# EAGLE design MPS (EAGLE 9.6.2)

## Sheet 1 of 2
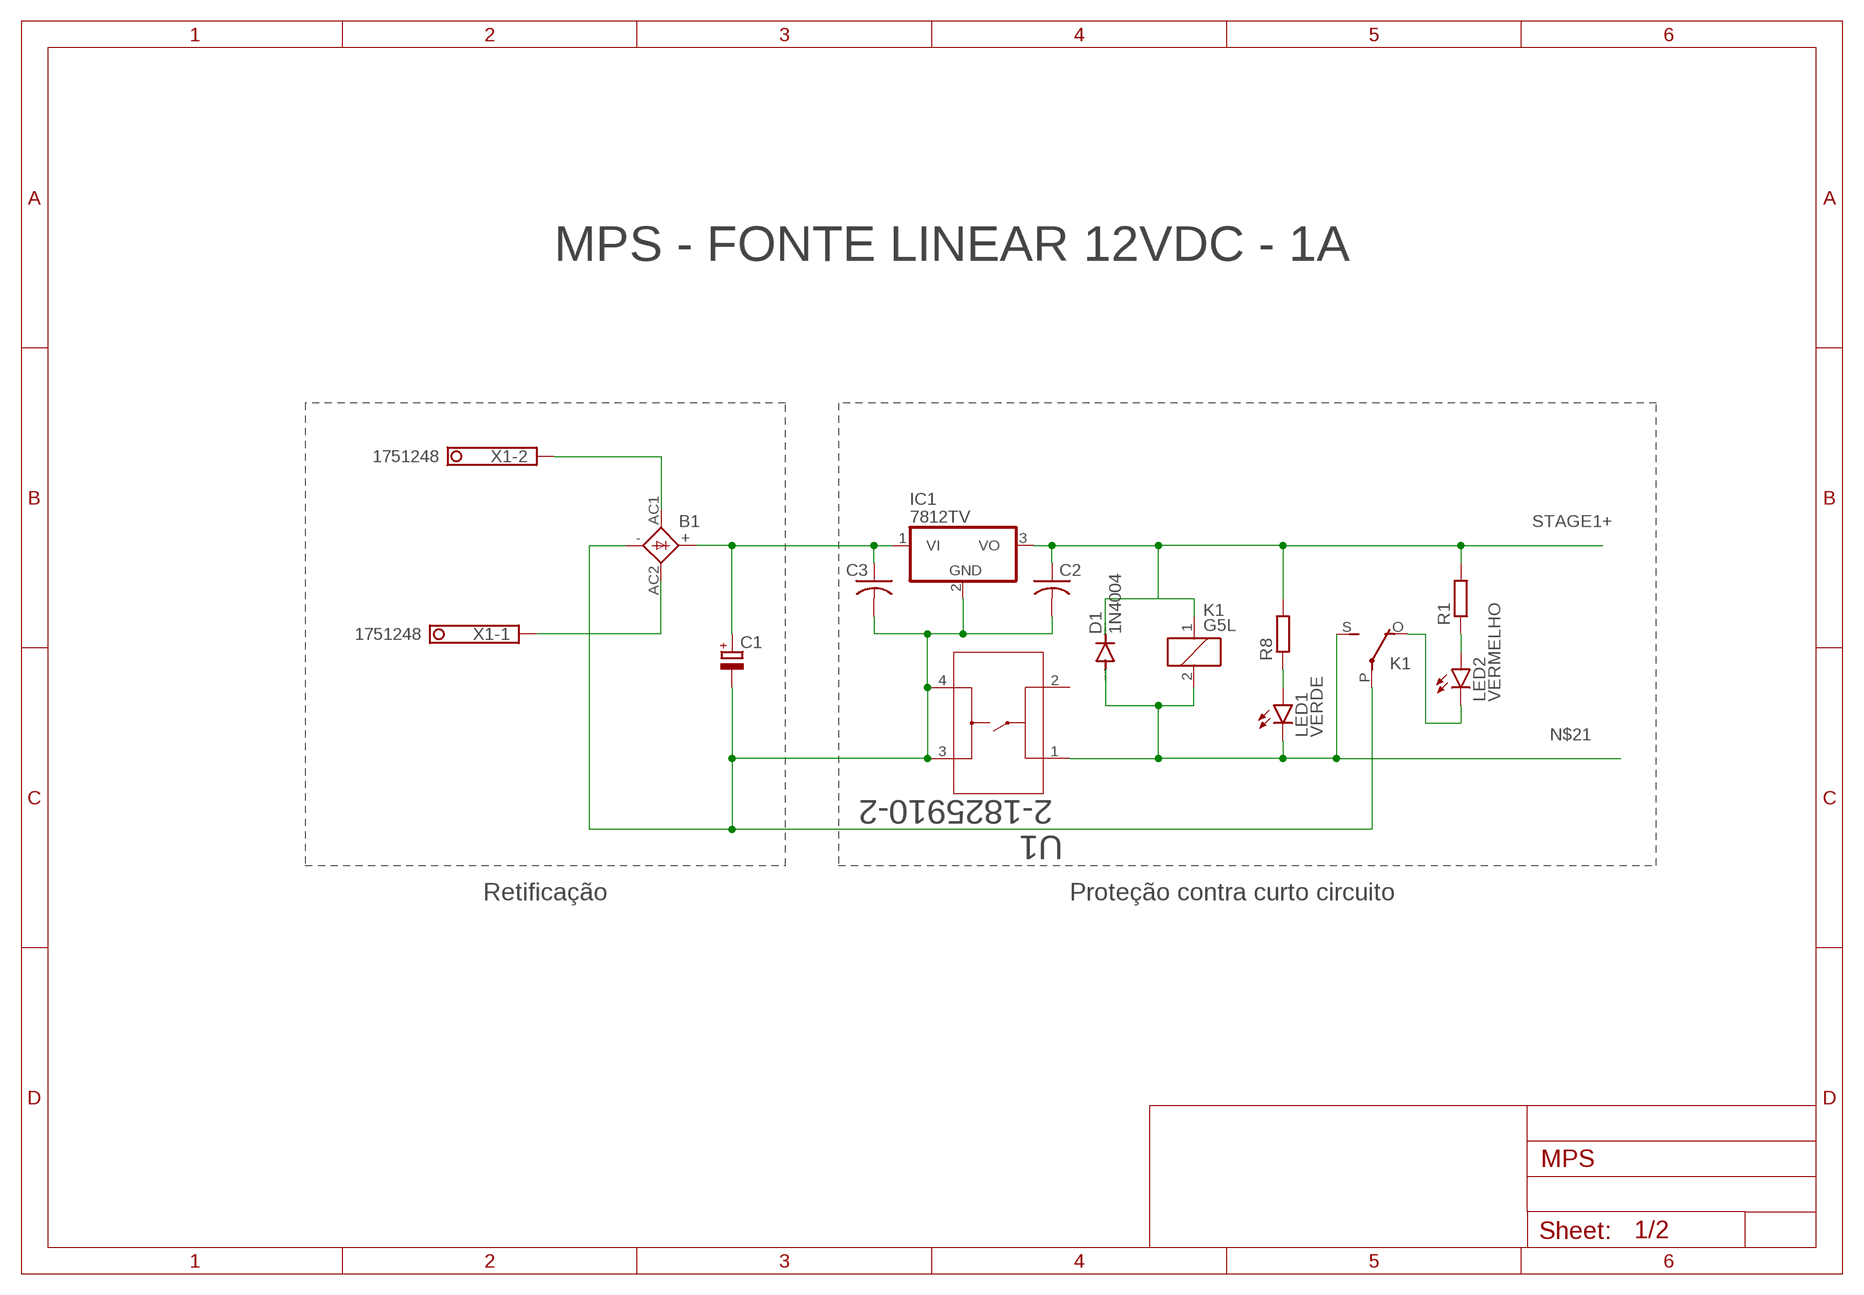
[diagram p0: schematic, sheet 1]

### Parts
B1  2KBB-R  [2KBB-R]
C1  CPOL-EUE2.5-7  [E2,5-7]
C2  C-US050-035X075  [C050-035X075]
C3  C-US050-035X075  [C050-035X075]
D1  1N4004  [DO41-10]
IC1  7812TV  [TO220V]
K1  G5L  [G5LE]
LED1  VERDE  LED3MM  [LED3MM]
LED2  VERMELHO  LED3MM  [LED3MM]
R1  R-EU_0207/7  [0207/7]
R8  R-EU_0207/7  [0207/7]
U1  2-1825910-2  [SWITCH_2-1825910-2]
X1  1751248  [1751248]

### Nets
N$2: B1.AC2 X1.1
N$5: K1.O(2:O) LED2.K(C)
N$6: LED1.A R8.1
N$8: B1.AC1 X1.2
N$10: LED2.A R1.1
N$12: B1.+ C1.+ C3.1 IC1.1(VI)
N$21: D1.A K1.2 K1.S(2:S) LED1.K(C) U1.1
STAGE1+: C2.1 D1.C IC1.3(VO) K1.1 R1.2 R8.2 ; also sheet 2
STAGE1-: B1.- C1.- C2.2 C3.2 IC1.2(GND) K1.P(2:P) U1.3 U1.4 ; also sheet 2
Unconnected: U1.2

### Notes on the sheet
- MPS - FONTE LINEAR 12VDC - 1A
- Retificação | Proteção contra curto circuito

## Sheet 2 of 2
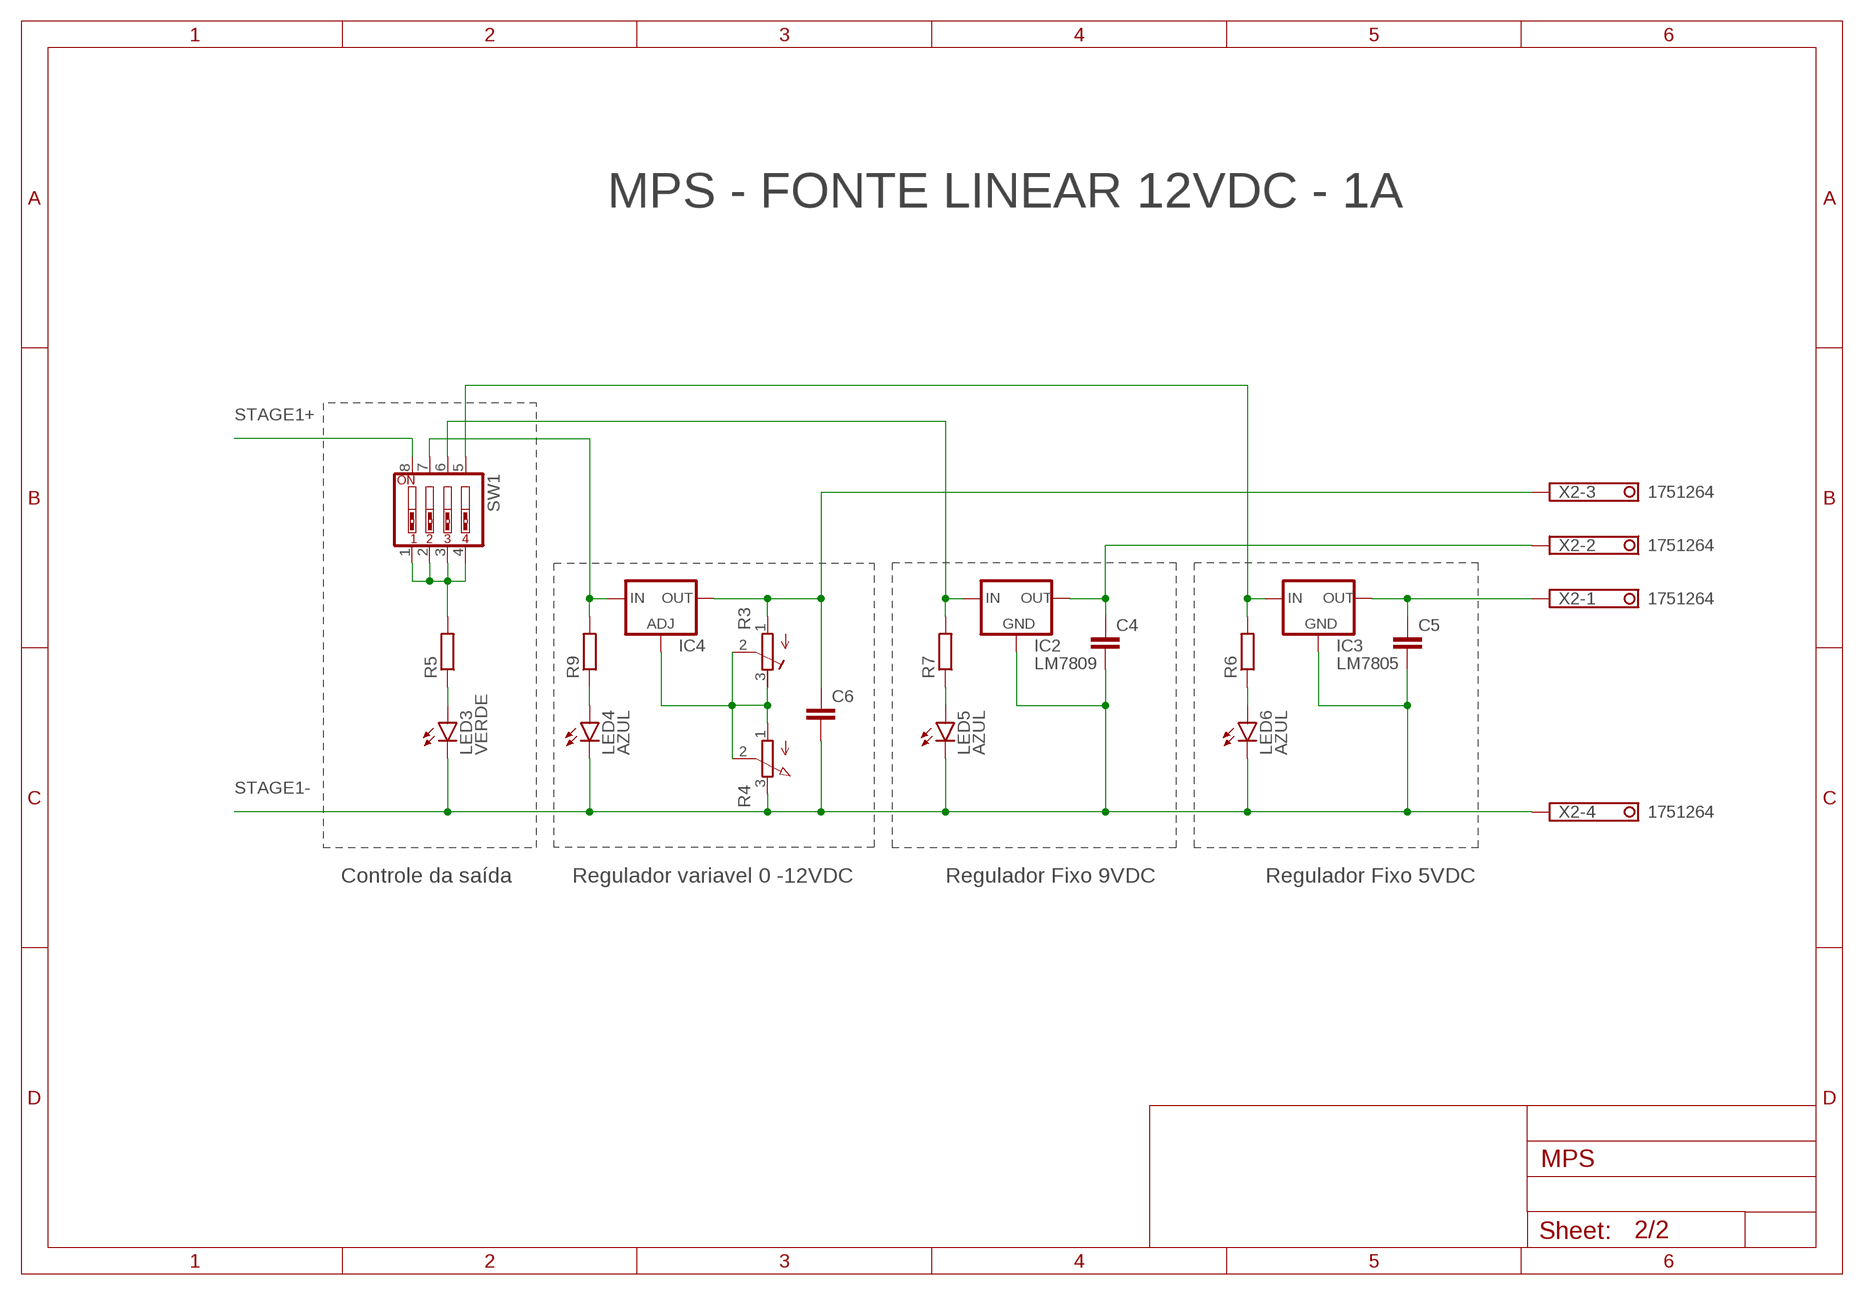
[diagram p1: schematic, sheet 2]

### Parts
C4  C-EU025-030X050  [C025-030X050]
C5  C-EU025-030X050  [C025-030X050]
C6  C-EU025-030X050  [C025-030X050]
IC2  LM7809  78XXS  [78XXS]
IC3  LM7805  78XXS  [78XXS]
IC4  LM317TS  [317TS]
LED3  VERDE  LED3MM  [LED3MM]
LED4  AZUL  LED3MM  [LED3MM]
LED5  AZUL  LED3MM  [LED3MM]
LED6  AZUL  LED3MM  [LED3MM]
R3  R-TRIMM64W  [RTRIM64W]
R4  3RP/1610N  [3RP/1610N]
R5  R-EU_0207/7  [0207/7]
R6  R-EU_0207/7  [0207/7]
R7  R-EU_0207/7  [0207/7]
R9  R-EU_0207/7  [0207/7]
SW1  SW_DIP-4  [EDG-04]
X2  1751264  [1751264]

### Nets
N$1: IC4.1(ADJ) R3.2(S) R3.3(E) R4.1(A) R4.2(S)
N$3: C5.1 IC3.OUT X2.1
N$4: C4.1 IC2.OUT X2.2
N$7: IC4.3(IN) R9.2 SW1.7
N$9: LED3.A R5.1
N$13: IC2.IN R7.2 SW1.6
N$14: IC3.IN R6.2 SW1.5
N$15: LED4.A R9.1
N$16: LED5.A R7.1
N$17: C6.1 IC4.2(OUT) R3.1(A) X2.3
N$18: LED6.A R6.1
N$19: R5.2 SW1.1 SW1.2 SW1.3 SW1.4
STAGE1+: SW1.8 ; also sheet 1
STAGE1-: C4.2 C5.2 C6.2 IC2.GND IC3.GND LED3.K(C) LED4.K(C) LED5.K(C) LED6.K(C) R4.3(E) X2.4 ; also sheet 1

### Notes on the sheet
- MPS - FONTE LINEAR 12VDC - 1A
- Controle da saída | Regulador variavel 0 -12VDC | Regulador Fixo 9VDC | Regulador Fixo 5VDC

## Library data of the parts
B1 = rectifier:2KBB-R: RECTIFIER grid 3 x 5 mm
C1 = rcl:CPOL-EU: POLARIZED CAPACITOR, European symbol; SPICEPREFIX: C
C2 C3 = rcl:C-US: CAPACITOR, American symbol; SPICEPREFIX: C
C4-C6 = rcl:C-EU: CAPACITOR, European symbol; SPICEPREFIX: C
D1 = diode:1N4004: DIODE general purpose rectifier, 1 A
IC1 = linear:78*: Positive VOLTAGE REGULATOR Source: http://cache.national.com/ds/LM/LM78L05.pdf http://www.fairchildsemi.com/ds/LM/LM7805.pdf
IC2 IC3 = v-reg:78XXS: VOLTAGE REGULATOR
IC4 = v-reg:LM317TS: VOLTAGE REGULATOR
K1 = relay:G5L: RELAY 1 x switch, 10 A/120 V AC, 8 A/30 V ADC, Omron; OC_FARNELL: unknown; OC_NEWARK: unknown
LED1-LED6 = led:LED: LED OSRAM: - CHIPLED LG R971, LG N971, LY N971, LG Q971, LY Q971, LO R971, LY R971 LH N974, LH R974 LS Q976, LO Q976, LY Q976 LO Q996 - Hyper CHIPLED LW Q18S LB Q993, LB Q99A, LB R99A - SideLED LS A670, LO A670, LY A670, LG A670, LP A670 LB A673, LV A673, LT A673, LW A673 LH A674 LY A675 LS A676, LA A676, LO A676, LY A676, LW A676 LS A679, LY A679, LG A679 - Hyper Micro SIDELED® LS Y876, LA Y876, LO Y876, LY Y876 LT Y87S - SmartLED LW L88C, LW L88S LB L89C, LB L89S, LG L890 LS L89K, LO L89K, LY L89K LS L896, LA L896, LO L896, LY L896 - TOPLED LS T670, LO T670, LY T670, LG T670, LP T670 LSG T670, LSP T670, LSY T670, LOP T670, LYG T670 LG T671, LOG T671, LSG T671 LB T673, LV T673, LT T673, LW T673 LH T674 LS T676, LA T676, LO T676, LY T676, LB T676, LH T676, LSB T676, LW T676 LB T67C, LV T67C, LT T67C, LS T67K, LO T67K, LY T67K, LW E67C LS E67B, LA E67B, LO E67B, LY E67B, LB E67C, LV E67C, LT E67C LW T67C LS T679, LY T679, LG T679 LS T770, LO T770, LY T770, LG T770, LP T770 LB T773, LV T773, LT T773, LW T773 LH T774 LS E675, LA E675, LY E675, LS T675 LS T776, LA T776, LO T776, LY T776, LB T776 LHGB T686 LT T68C, LB T68C - Hyper Mini TOPLED® LB M676 - Mini TOPLED Santana® LG M470 LS M47K, LO M47K, LY M47K Source: http://www.osram.convergy.de LUXEON: - LUMILED® LXK2-PW12-R00, LXK2-PW12-S00, LXK2-PW14-U00, LXK2-PW14-V00 LXK2-PM12-R00, LXK2-PM12-S00, LXK2-PM14-U00 LXK2-PE12-Q00, LXK2-PE12-R00, LXK2-PE12-S00, LXK2-PE14-T00, LXK2-PE14-U00 LXK2-PB12-K00, LXK2-PB12-L00, LXK2-PB12-M00, LXK2-PB14-N00, LXK2-PB14-P00, LXK2-PB14-Q00 LXK2-PR12-L00, LXK2-PR12-M00, LXK2-PR14-Q00, LXK2-PR14-R00 LXK2-PD12-Q00, LXK2-PD12-R00, LXK2-PD12-S00 LXK2-PH12-R00, LXK2-PH12-S00 LXK2-PL12-P00, LXK2-PL12-Q00, LXK2-PL12-R00 Source: www.luxeon.com KINGBRIGHT: KA-3528ASYC Source: www.kingbright.com
R1 R5-R9 = rcl:R-EU_: RESISTOR, European symbol; SPICEPREFIX: R
R3 = rcl:R-TRIMM: Trimm resistor; SPICEMODEL: X; SPICEPREFIXL: POT
R4 = pot:3RP/1610N: 16mm Potentiometer one level Source: http://www.alphapotentiometers.net/html/16mm_pot_2.html
SW1 = special:SW_DIP-4: DIP SWITCH
U1 = Switches:2-1825910-2; BUILT_BY: EMA_UL_Team; CATEGORY: Tactile Switches; COPYRIGHT: Copyright (C) 2016 Accelerated Designs. All rights reserved; DESCRIPTION: FSM12JH=6MM TACT SWITCH, HIGH TEMP; MANUFACTURER_PART_NUMBER: 2-1825910-2; PART_STATUS: active; SERIES: Unknown; VENDOR: TE Connectivity
X1 = con-phoenix-350:1751248: MKDS 1/ 2-3,5 Printklemme Nennstrom: 10 A Bemessungsspannung: 160 V Raster: 3,5 mm Polzahl: 2 Montageart: Löten Anschlussart: Schraubanschluss Anschlussrichtung vom Leiter zur Platine: 0° Source: http://eshop.phoenixcontact.com .. 1751248.pdf; OC_FARNELL: unknown; OC_NEWARK: unknown
X2 = con-phoenix-350:1751264: MKDS 1/ 4-3,5 Printklemme Nennstrom: 10 A Bemessungsspannung: 160 V Raster: 3,5 mm Polzahl: 4 Montageart: Löten Anschlussart: Schraubanschluss Anschlussrichtung vom Leiter zur Platine: 0° Source: http://eshop.phoenixcontact.com .. 1751264.pdf; MPN: 1751264; OC_FARNELL: unknown; OC_NEWARK: 10R0934

## Board
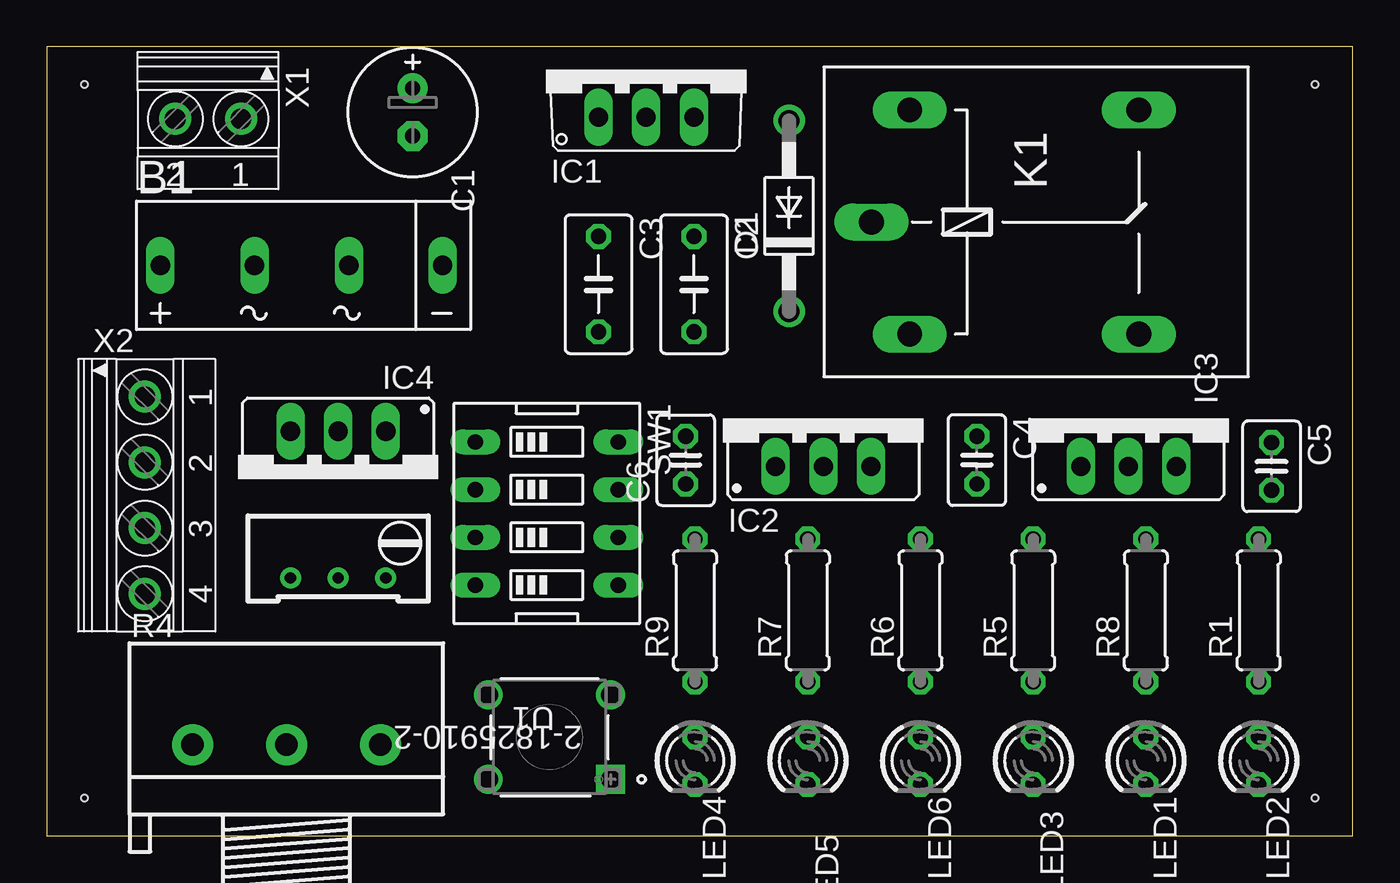
[diagram p2: board, top side]
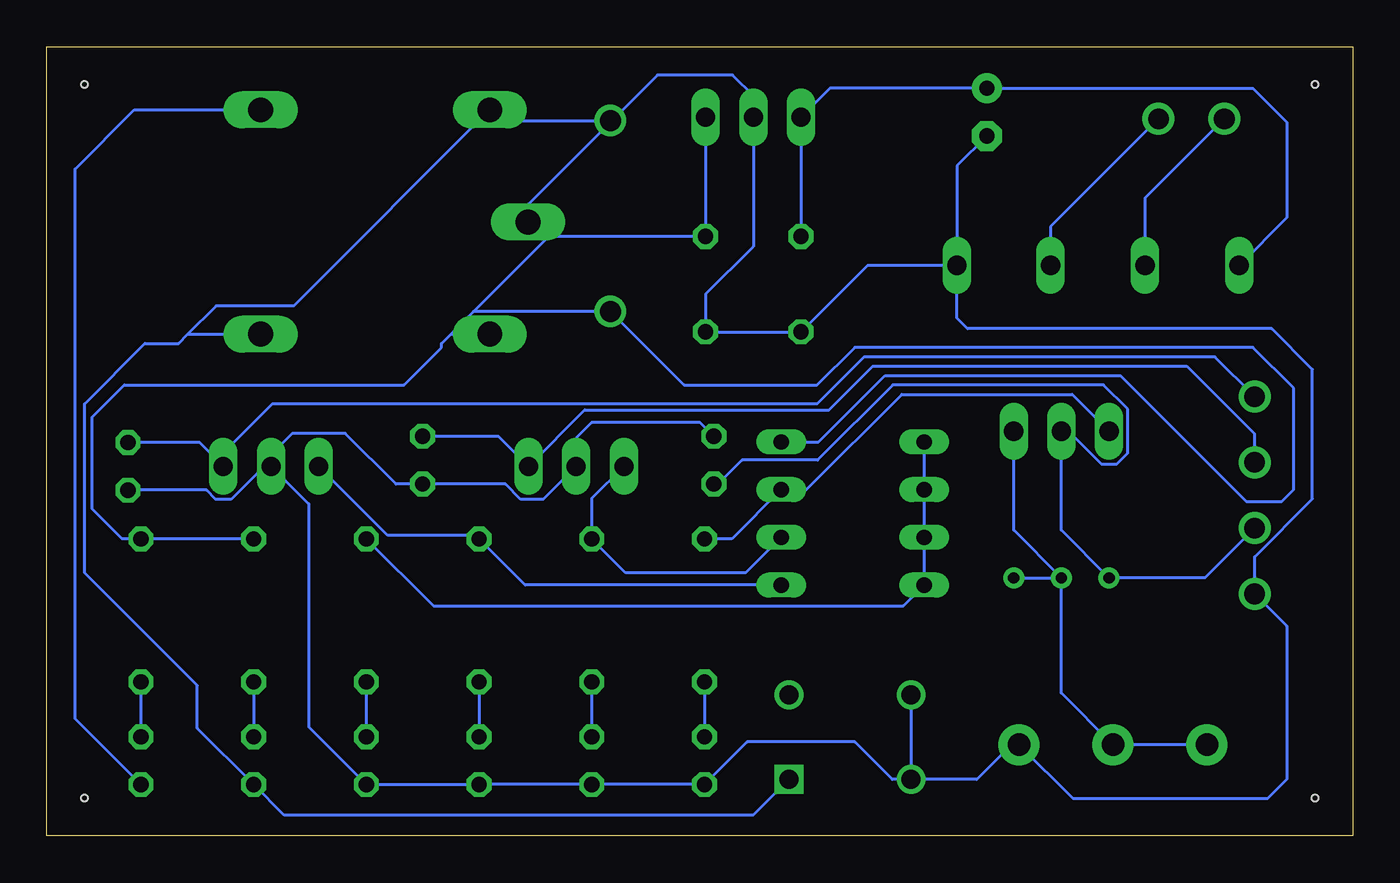
[diagram p3: board, bottom side, seen from below]

Size 69.5 x 42 mm. Coordinates in mm from the lower left corner, seen from the top.
Outline: 0,0 69.5,0 69.5,42 0,42 0,0
Copper layers (1*16): Top 0.035mm / dielectric 1.5mm / Bottom 0.035mm
Design rules "default": minimum track width 6mil, minimum drill 0.35mm, track to track 6mil, track to pad 6mil, pad to pad 6mil, via to via 6mil, smd to smd 6mil, copper to edge 40mil, drill to drill 6mil, minimum pad ring 10mil, minimum via ring 8mil, stop-mask expansion 4mil, vias tented up to drill 0mil, thermal gap 10mil
Holes 0.35 mm at 2,2 67.5,40 67.5,2 2,40

### Footprints (pad centres in the part's own frame; a part is rotated, then mirrored left to right if it is on the bottom)
2KBB-R = drill 1.016 long: + -7.62,0; - 7.391,0; AC1 -2.616,0; AC2 2.413,0
E2,5-7 = drill 0.813 pad 1.6: + -1.27,0 | drill 0.813 pad 1.6 octagon: - 1.27,0
C050-035X075 = drill 0.813 octagon: 1 -2.54,0; 2 2.54,0
C025-030X050 = drill 0.813 octagon: 1 -1.27,0; 2 1.27,0
DO41-10 = drill 1.118: A 5.08,0; C -5.08,0
TO220V = drill 1.016 long: 1 -2.54,-2.54; 2 0,-2.54; 3 2.54,-2.54
78XXS = drill 1.016 long: GND 0,-2.54; IN -2.54,-2.54; OUT 2.54,-2.54
317TS = drill 1.016 long: 1 -2.54,-2.54; 2 0,-2.54; 3 2.54,-2.54
G5LE = drill 1.321 long: 1 -7.493,-5.969; 2 -7.493,5.969; O 4.699,5.969; P -9.525,0; S 4.699,-5.969
LED3MM = drill 0.813 octagon: A -1.27,0; K 1.27,0
0207/7 = drill 0.813 octagon: 1 -3.81,0; 2 3.81,0
RTRIM64W = drill 0.61: 1 1.27,-2.54; 2 1.27,0; 3 1.27,2.54
3RP/1610N = drill 1.2 pad 2.184: 1 -5,0; 2 0,0; 3 5,0
EDG-04 = drill 0.813 long: 1 -3.81,-3.81; 2 -1.27,-3.81; 3 1.27,-3.81; 4 3.81,-3.81; 5 3.81,3.81; 6 1.27,3.81; 7 -1.27,3.81; 8 -3.81,3.81
SWITCH_2-1825910-2 = drill 1.016 pad 1.524 square: 1 -6.502,4.496 | drill 1.016 pad 1.524: 2 -6.502,0; 3 0,0; 4 0,4.496
1751248 = drill 1.1 pad 1.7: 1 -1.75,-0.1; 2 1.75,-0.1
1751264 = drill 1.1 pad 1.7: 1 -5.25,-0.1; 2 -1.75,-0.1; 3 1.75,-0.1; 4 5.25,-0.1

### Placement (x,y rotation side)
B1  13.66,30.37 0 top
C1  19.47,38.53 270 top
C2  34.44,29.37 270 top
C3  29.36,29.37 270 top
C4  49.5,20 270 top
C5  65.19,19.67 270 top
C6  34,20 90 top
D1  39.5,33 90 top
IC1  31.9,40.8 0 top
IC2  41.33,22.21 0 top
IC3  57.57,22.21 0 top
IC4  15.5,19 180 top
K1  53.42,32.68 0 top
LED1  58.5,4 270 top
LED2  64.5,4 270 top
LED3  52.5,4 270 top
LED4  34.5,4 270 top
LED5  40.5,4 270 top
LED6  46.5,4 270 top
R1  64.5,12 90 top
R3  15.5,15 270 top
R4  12.75,4.85 0 top
R5  52.5,12 90 top
R6  46.5,12 90 top
R7  40.5,12 90 top
R8  58.5,12 90 top
R9  34.5,12 90 top
SW1  26.61,17.16 270 top
U1  23.5,7.5 180 top
X1  8.58,38.07 180 top
X2  5.31,18.13 270 top

### Tracks (layer width: path | path; a pad name or v marks a point on that pad's centre or on a via)
N$1
  Bottom 0.152: R4.1 R4.2 15.5,7.6 R3.2 | R3.2 18.04,16.27 IC4.1 | R3.3 R3.2
N$2
  Bottom 0.152: X1.1 16.07,32.43 B1.AC2
N$3
  Bottom 0.152: C5.1 61.38,20.94 IC3.OUT 60.11,20.39 57.5,23 28.5,23 26,25.5 7.33,25.5 X2.1
N$4
  Bottom 0.152: X2.2 5.21,21.38 8.83,25 25.54,25 27.87,22.67 40.87,22.67 IC2.OUT 45.47,21.27 C4.1
N$5
  Bottom 0.152: LED2.K 68,6.23 68,35.5 64.85,38.65 K1.O
N$6
  Bottom 0.152: R8.1 LED1.A
N$7
  Bottom 0.152: R9.2 33.04,15.81 SW1.7 29.07,18.43 24,23.5 14.92,23.5 IC4.3
N$8
  Bottom 0.152: X1.2 11.04,33.96 B1.AC1
N$9
  Bottom 0.152: R5.1 LED3.A
N$10
  Bottom 0.152: R1.1 LED2.A
N$12
  Bottom 0.152: C3.1 IC1.1 27.82,39.8 C1.+ 5.3,39.8 3.5,38 3.5,32.91 B1.+
N$13
  Bottom 0.152: 30.53,16 SW1.6 32.31,14 38.69,14 R7.2 40.5,17.96 IC2.IN
N$14
  Bottom 0.152: SW1.5 44.04,13.35 R6.2 46.69,16 51.36,16 IC3.IN
N$15
  Bottom 0.152: R9.1 LED4.A
N$16
  Bottom 0.152: R7.1 LED5.A
N$17
  Bottom 0.152: X2.3 7.86,13.73 R3.1 15.5,16.27 IC4.2 15.12,21.54 13.37,19.79 12.55,19.79 11.97,20.37 11.97,22.71 13.26,24 24.47,24 28.47,20 32.5,20 33.77,18.73 C6.1
N$18
  Bottom 0.152: R6.1 LED6.A
N$19
  Bottom 0.152: SW1.1 SW1.2 SW1.3 SW1.4 23.91,12.24 48.93,12.24 R5.2
N$21
  Bottom 0.152: 62,26.71 K1.S | U1.1 31.91,1.09 56.86,1.09 LED1.K 61.5,5.73 61.5,8 67.5,14 67.5,23 64.29,26.21 62.5,26.21 62,26.71 | 62,26.71 60.5,28.21 56.36,28.21 K1.2 45.36,38.08 D1.A
STAGE1+
  Bottom 0.152: R8.2 R1.2 65.5,15.81 67.08,17.39 67.08,22.31 65.39,24 50.5,24 48.5,26 48.5,26.21 48,26.71 | 48,26.71 K1.1 | IC1.3 C2.1 42.8,31.91 46.79,27.92 | 46.79,27.92 48,26.71 | SW1.8 28.42,20.97 24.89,24.5 12.36,24.5 5.66,17.8 3.76,17.8 3.13,18.43 3.13,23.83 5.3,26 26.5,26 28.5,24 35.58,24 D1.C 46.79,27.92
STAGE1-
  Bottom 0.152: U1.4 20,3 18.15,4.85 R4.3 14.9,2 4.5,2 3.5,3 3.5,11.17 X2.4 5.21,14.86 2.13,17.93 2.13,24.83 4.3,27 20.5,27 21.05,27.55 B1.- | U1.4 24.5,3 26.5,5 32.23,5 LED4.K LED5.K LED6.K LED3.K 55.57,5.8 55.57,17.67 IC3.GND | IC3.GND 57.95,19.67 59.7,17.92 60.52,17.92 61,18.4 C5.2 | K1.P 43.9,33.6 37,40.5 33,40.5 31.9,39.4 IC1.2 31.9,31.37 34.44,28.83 C2.2 C3.2 25.82,30.37 B1.- | IC3.GND 57.57,20.29 56.44,21.42 53.62,21.42 50.93,18.73 C4.2 45.09,18.73 44.28,17.92 43.08,17.92 IC2.GND 41.33,21.17 40.5,22 34.73,22 C6.2 | C1.- 21.05,35.68 B1.- | U1.3 U1.4